# EAGLE design Poseidon (EAGLE 9.6.2)
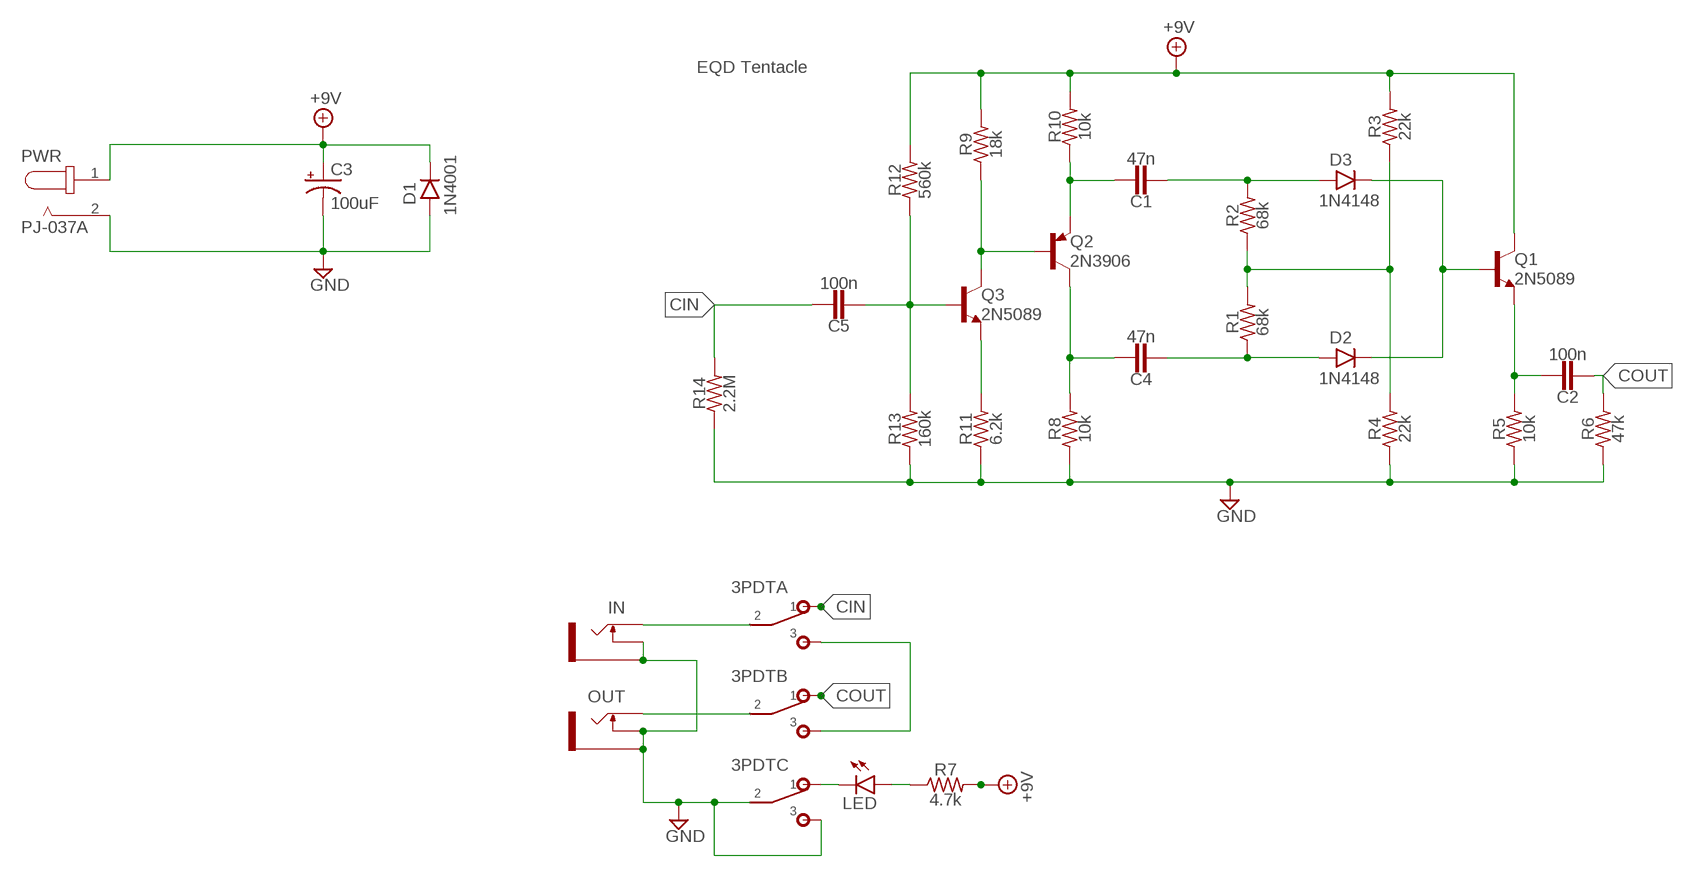
[diagram p0: schematic, sheet 1]

## Parts
3PDT  3PDT  [3PDT]
C1  47n  CAP.2  [0.2".SML]
C2  100n  CAP.2  [0.2".SML]
C3  100uF  0631  [063_025]
C4  47n  CAP.2  [0.2".SML]
C5  100n  CAP.2  [0.2".SML]
D1  1N4001  DO41.3  [DO41-3]
D2  1N4148  DO35.3  [DO35-3]
D3  1N4148  DO35.3  [DO35-3]
IN  NV-PJ3410_MONO  [NV-PJ3410_SOCKET_MONO]
LED  LED3MM  [LED3MM]
OUT  NV-PJ3410_MONO  [NV-PJ3410_SOCKET_MONO]
PWR  PJ-037A  [CUI_PJ-037A]
Q1  2N5089  2N5088  [TO92]
Q2  2N3906  2N5087  [TO92]
Q3  2N5089  2N5088  [TO92]
R1  68k  R.3B  [0.3".B]
R2  68k  R.3B  [0.3".B]
R3  22k  R.3B  [0.3".B]
R4  22k  R.3B  [0.3".B]
R5  10k  R.3B  [0.3".B]
R6  47k  R.3B  [0.3".B]
R7  4.7k  R.3B  [0.3".B]
R8  10k  R.3B  [0.3".B]
R9  18k  R.3B  [0.3".B]
R10  10k  R.3B  [0.3".B]
R11  6.2k  R.3B  [0.3".B]
R12  560k  R.3B  [0.3".B]
R13  160k  R.3B  [0.3".B]
R14  2.2M  R.3B  [0.3".B]

## Nets
+9V: C3.+ D1.C PWR.1 Q1.1(C) R3.2 R7.2 R9.2 R10.2 R12.2
CIN: 3PDT.A1 C5.1 R14.2
COUT: 3PDT.B1 C2.2 R6.2
GND: 3PDT.C2 3PDT.C3 C3.- D1.A IN.GND(SLEEVE) IN.SWITCH OUT.GND(SLEEVE) OUT.SWITCH PWR.2 R4.1 R5.1 R6.1 R8.1 R11.1 R13.1 R14.1
N$1: 3PDT.A3 3PDT.B3
N$2: C5.2 Q3.2(B) R12.1 R13.2
N$3: 3PDT.C1 LED.K(C)
N$4: Q3.3(E) R11.2
N$5: LED.A R7.1
N$6: Q2.2(B) Q3.1(C) R9.1
N$7: C1.1 Q2.3(E) R10.1
N$8: 3PDT.A2 IN.LEFT(TIP)
N$9: C4.1 Q2.1(C) R8.2
N$10: C4.2 D2.A R1.1
N$11: R1.2 R2.1 R3.1 R4.2
N$12: C1.2 D3.A R2.2
N$13: 3PDT.B2 OUT.LEFT(TIP)
N$14: D2.C D3.C Q1.2(B)
N$16: C2.1 Q1.3(E) R5.2

## Notes on the sheet
- EQD Tentacle

## Library data of the parts
3PDT = switches:3PDT: Mountain Switch 108-1M31T1B1M1QE-EVX https://www.mouser.com/ProductDetail/Mountain-Switch/108-1M31T1B1M1QE-EVX?qs=sGAEpiMZZMvudeGI7i40XO%252BnGhp8Hy%252BJe46O%2FBjy5XE%3D
C1 C2 C4 C5 = caps-film:CAP: For Ceramic, Film, MLCC caps
C3 = caps-elec:063: 33 - 220uF Xicon values at Mouser.com 10V: 220uF; 16V: 100uF; 25V: 100uF; 50V: 33uF
D1 = diodes:DO41: DO-41 Package Diodes: 1N4001 - 1N40019 Zener Diodes: 1N4728 - 1N4764
D2 D3 = diodes:DO35: DO-35 Package Diodes: 1N914
IN OUT = MusicThingModular:NV-PJ3410_MONO
LED = diodes:LED
PWR = PJ-037A:PJ-037A: 2.0 mm Center Pin, 2.5 A, Right Angle, Through Hole, Dc Power Jack Connector; AVAILABILITY: Unavailable; CUI_PURCHASE_URL: https://www.cuidevices.com/product/interconnect/connectors/dc-power-connectors/jacks/pj-037a?utm_source=snapeda.com&utm_medium=referral&utm_campaign=snapedaBOM; DESCRIPTION: 2.0 x 6.5 mm, 2.5 A, Horizontal, Through Hole, Dc Power Jack Connector; MF: CUI Devices; MP: PJ-037A; PACKAGE: None; PRICE: None
Q1 Q3 = transistors-BJT:2N5088: NPN - 2n5088, 2n5089, 2n3904, MPSA18 [C]-B-E pinout 2n5088: http://smallbear-electronics.mybigcommerce.com/transistor-2n5088/ 2n5089: http://smallbear-electronics.mybigcommerce.com/transistor-2n5089/ 2n5089: http://smallbear-electronics.mybigcommerce.com/transistor-2n5089-motorola/ 2n3904: http://smallbear-electronics.mybigcommerce.com/transistor-2n3904/ MPSA18: http://smallbear-electronics.mybigcommerce.com/transistor-mpsa18/
Q2 = transistors-BJT:2N5087: PNP - 2n5087, 2n3906 [C]-B-E pinout 2n5087: http://smallbear-electronics.mybigcommerce.com/transistor-2n5087/ 2n3906: http://smallbear-electronics.mybigcommerce.com/transistor-2n3906/
R1-R14 = resistors:R: 1/8W, 1/4W and 1W resistors

## Board
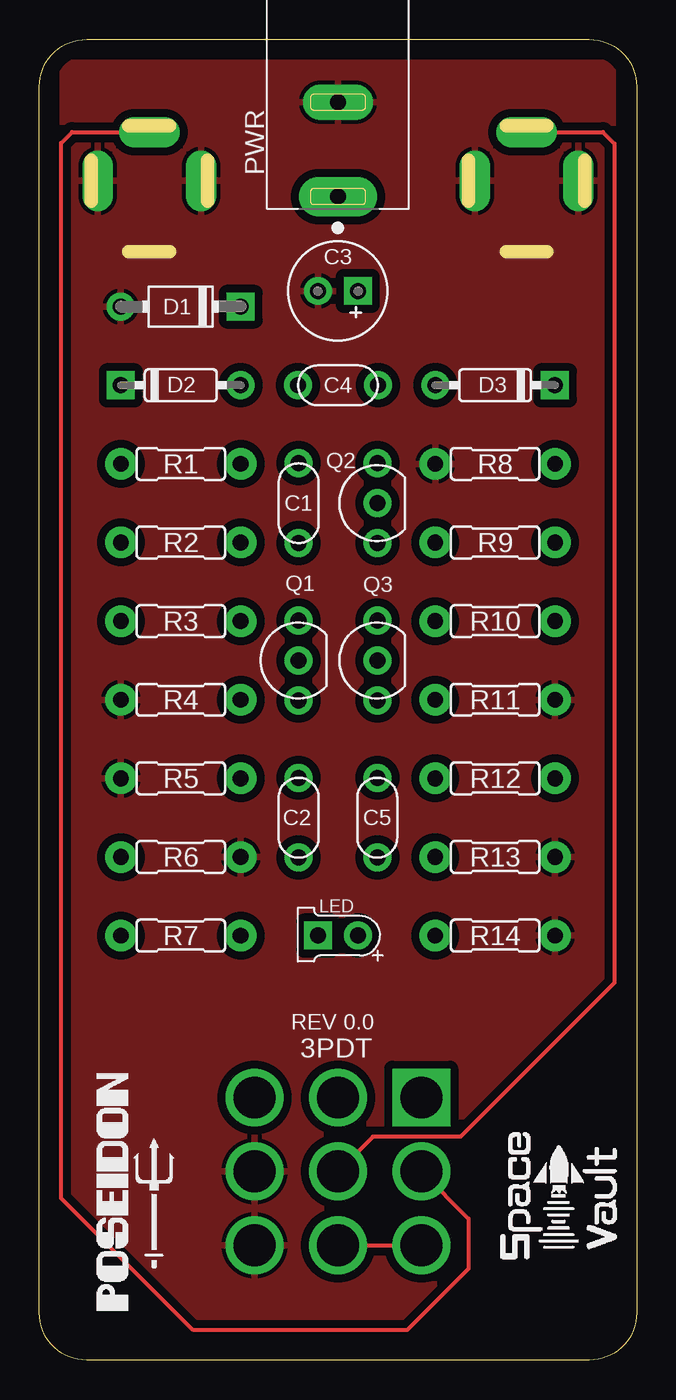
[diagram p1: board, top side]
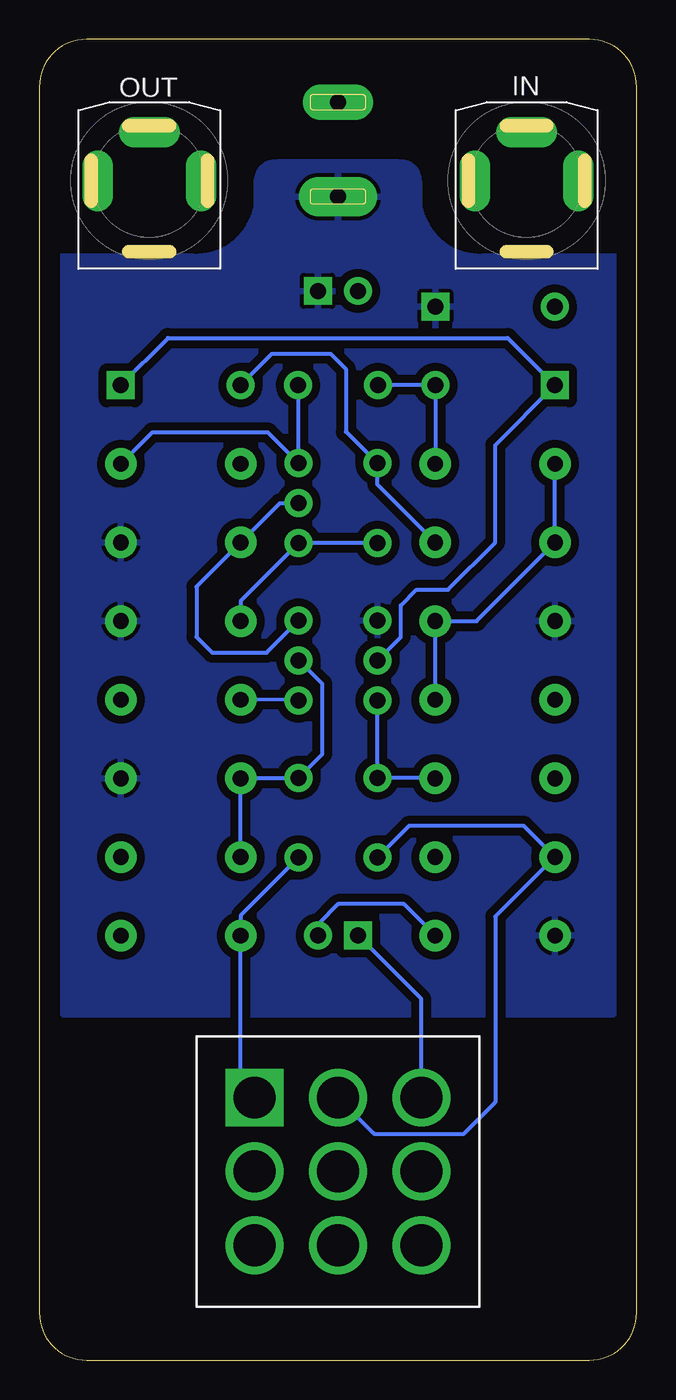
[diagram p2: board, bottom side, seen from below]

Size 38 x 84 mm. Coordinates in mm from the lower left corner, seen from the top.
Outline: 0,81 arc-90 3,84 35,84 arc-90 38,81 38,3 arc-90 35,0 3,0 arc-90 0,3 0,81
Copper layers (1*16): Top 0.035mm / dielectric 1.5mm / Bottom 0.035mm
Design rules "default": minimum track width 6mil, minimum drill 0.35mm, track to track 6mil, track to pad 6mil, pad to pad 6mil, via to via 6mil, smd to smd 6mil, copper to edge 40mil, drill to drill 6mil, minimum pad ring 10mil, minimum via ring 8mil, stop-mask expansion 4mil, vias tented up to drill 0mil, thermal gap 10mil
bRestrict: 12 lines

### Footprints (pad centres in the part's own frame; a part is rotated, then mirrored left to right if it is on the bottom)
3PDT = drill 2.667 square: A1 -5.3,4.7 | drill 2.667: A2 -5.3,0; A3 -5.3,-4.7; B1 0,4.7; B2 0,0; B3 0,-4.7; C1 5.3,4.7; C2 5.3,0; C3 5.3,-4.7
0.2".SML = drill 1.016 pad 1.778: 1 -2.54,0; 2 2.54,0
063_025 = drill 1.016 pad 1.778 square: + -1.27,0 | drill 1.016 pad 1.778: - 1.27,0
DO41-3 = drill 1.016 pad 1.778: A 3.81,0 | drill 1.016 pad 1.778 square: C -3.81,0
DO35-3 = drill 1.016 pad 1.778: A 3.81,0 | drill 1.016 pad 1.778 square: C -3.81,0
NV-PJ3410_SOCKET_MONO = drill 0.025 pad 1.93 long: GND 3.3,0; LEFT 0,3.1; SWITCH -3.3,0
LED3MM = drill 1.016 pad 1.778: A -1.27,0 | drill 1.016 pad 1.778 square: K 1.27,0
CUI_PJ-037A = drill 1 pad 2.5 long: 1 0,0 | drill 1 pad 2.25 long: 2 6,0
TO92 = drill 1.016 pad 1.778: 1 -2.54,0; 2 0,0; 3 2.54,0
0.3".B = drill 1 pad 2: 1 -3.81,0; 2 3.81,0

### Placement (x,y rotation side)
3PDT  19,12 0 bottom
C1  16.5,54.5 90 top
C2  16.5,34.5 270 top
C3  19,68 180 top
C4  19,62 180 top
C5  21.5,34.5 90 top
D1  9,67 180 top
D2  9,62 0 top
D3  29,62 180 top
IN  7,75 0 bottom
LED  19,27 180 top
OUT  31,75 0 bottom
PWR  19,74 90 top
Q1  16.5,44.5 270 top
Q2  21.5,54.5 270 top
Q3  21.5,44.5 270 top
R1  9,57 180 top
R2  9,52 0 top
R3  9,47 180 top
R4  9,42 0 top
R5  9,37 0 top
R6  9,32 180 top
R7  9,27 180 top
R8  29,57 0 top
R9  29,52 0 top
R10  29,47 0 top
R11  29,42 180 top
R12  29,37 0 top
R13  29,32 180 top
R14  29,27 180 top

### Tracks (layer width: path | path; a pad name or v marks a point on that pad's centre or on a via)
+9V
  pour Bottom (isolate 0.508): 36.49,22 36.49,77 1.49,77 1.49,22
CIN
  Bottom 0.254: C5.1 25.19,28.27 R14.2 | R14.2 | 3PDT.A1 25.19,17.59 R14.2
COUT
  Bottom 0.254: 3PDT.B1 16.7,14.4 10.98,14.4 8.98,16.41 8.98,28.21 R6.2 7.19,34.01 14.46,34.01 C2.2
GND
  pour Top (isolate 0.508): 1.49,2 36.49,2 36.49,82.5 1.49,82.5
N$1
  Top 0.254: 3PDT.B3 3PDT.A3
N$2
  Bottom 0.254: R13.2 R12.1 25.15,37.04 C5.2 19.98,38.56 19.98,43.01 21.48,44.5 Q3.2
N$3
  Bottom 0.254: 3PDT.C1 13.7,22.97 LED.K
N$4
  Bottom 0.254: Q3.3 21.54,42 R11.2
N$5
  Bottom 0.254: R7.1 14.81,29 18.98,29 20.27,27.72 LED.A
N$6
  Bottom 0.254: Q2.2 22.69,54.5 R9.1 28,49.19 28,46 27,45 23.54,45 Q3.1
N$7
  Bottom 0.254: C1.1 Q2.3 25.19,48.27 R10.1
N$8
  Top 0.254: IN.LEFT 2.08,78.1 1.39,77.41 1.39,10.3 9.79,1.91 23.39,1.91 27.3,5.82 27.3,9 3PDT.A2
N$9
  Bottom 0.254: C4.1 21.54,57.08 Q2.1 23.46,59 30.81,59 R8.2
N$10
  Bottom 0.254: R1.1 D2.A C4.2
N$11
  Bottom 0.254: R4.2 R3.1 10.19,47 R2.1 R1.2
N$12
  Bottom 0.254: R2.2 16.5,55.69 C1.2 18.5,59.04 18.5,63.04 19.46,64 23.19,64 D3.A
N$13
  Top 0.254: OUT.LEFT 35.86,78.1 36.59,77.37 36.59,24 26.8,14.22 21.22,14.22 3PDT.B2
N$14
  Bottom 0.254: Q1.2 15,46 15,48 14,49 12,49 9,52 9,58.19 D2.C 8.19,65 29.81,65 D3.C
N$16
  Bottom 0.254: R5.2 12.85,37.04 C2.1 Q1.3

### Text on the board
tPlace: REV 0.0